# EAGLE design Adafruit ItsyBitsy M4 (EAGLE 9.0.1)
COMPANY: ADAFRUIT INDUSTRIES; DRAWN: KTOWN; REV: B
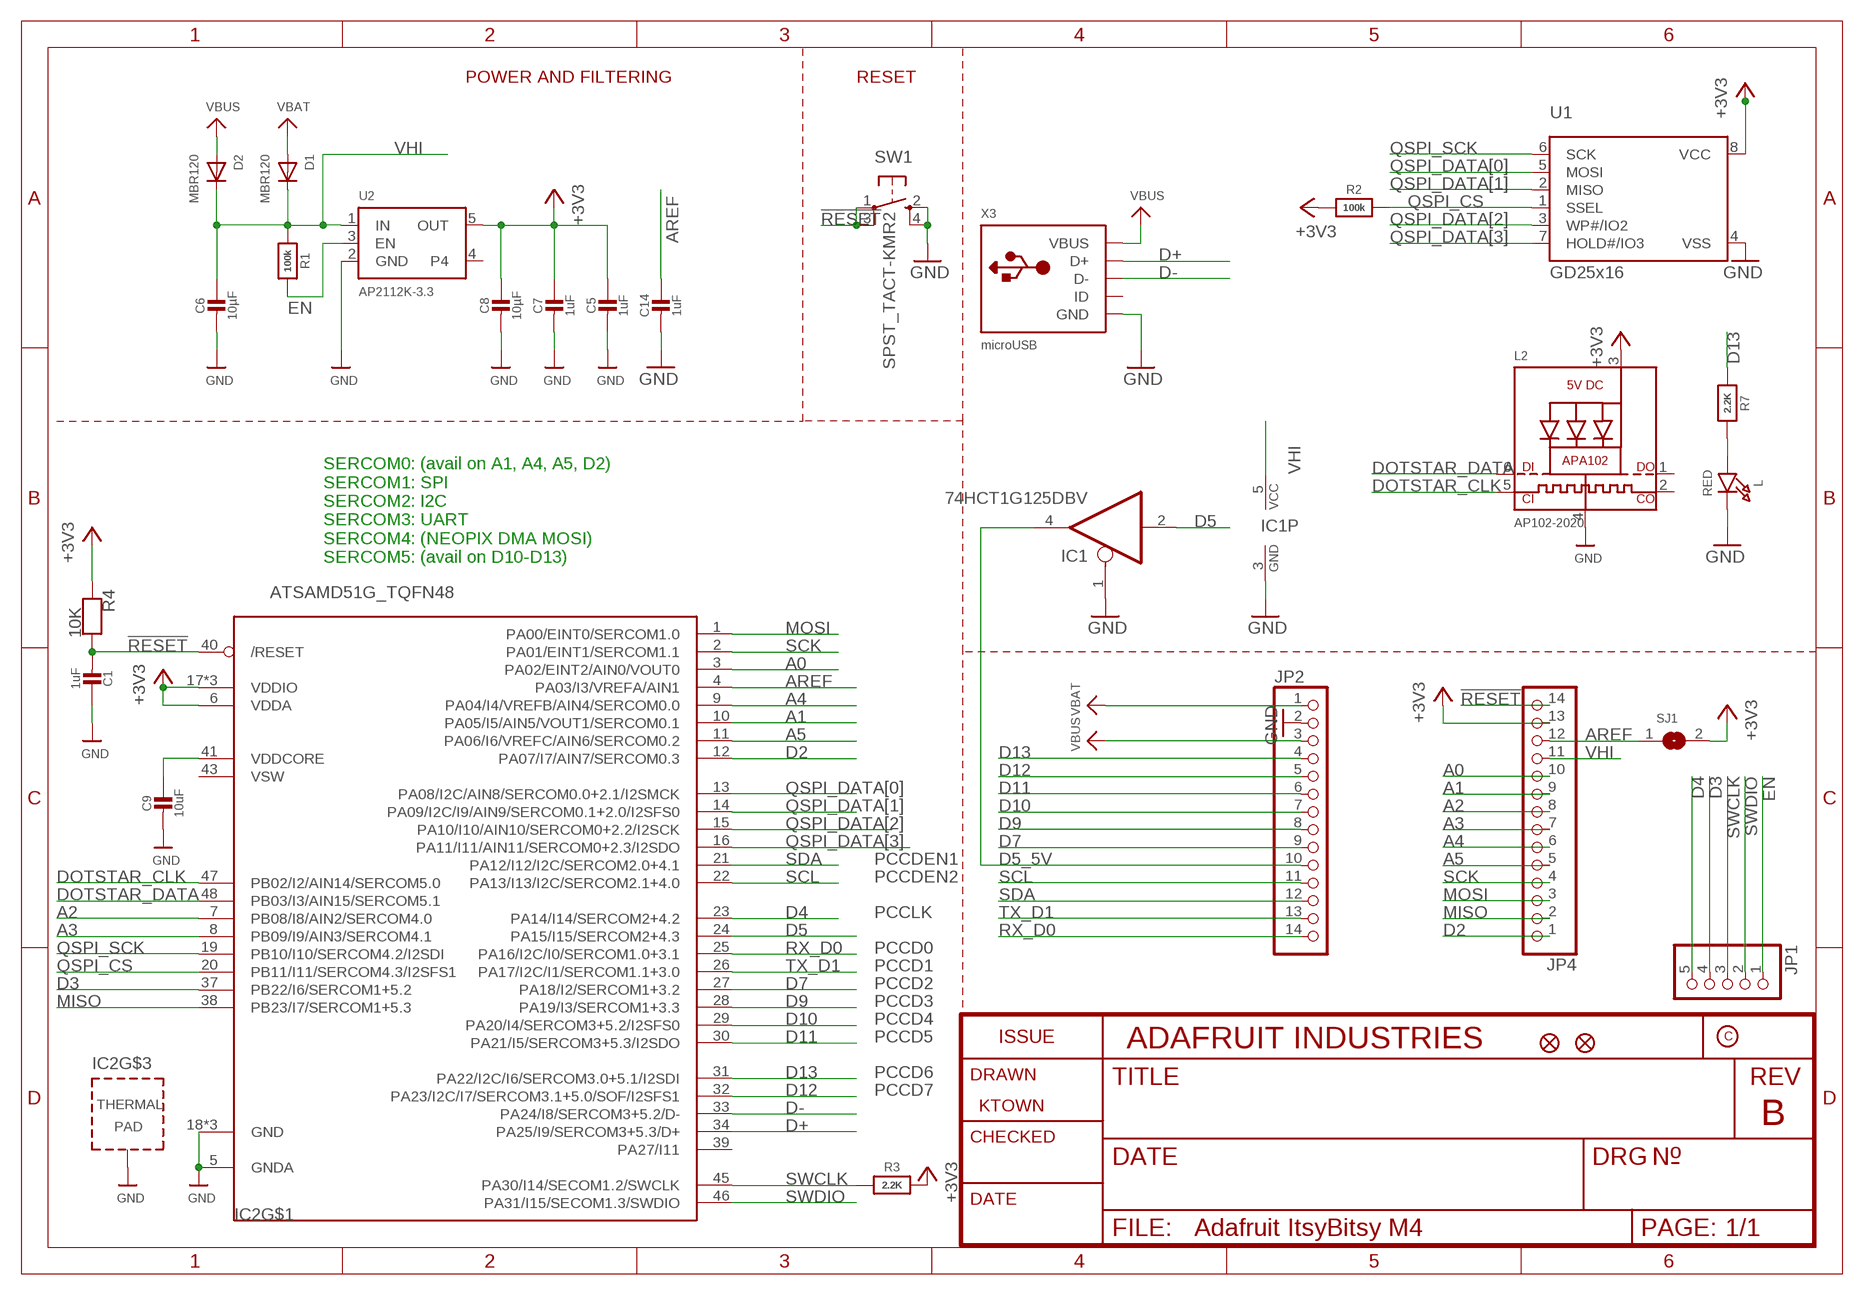
[diagram p0: schematic, sheet 1]

## Parts
C1  1uF  CAP_CERAMIC_0603MP  [_0603MP]
C5  1uF  CAP_CERAMIC0603_NO  [0603-NO]
C6  10µF  CAP_CERAMIC0805-NOOUTLINE  [0805-NO]
C7  1uF  CAP_CERAMIC0603_NO  [0603-NO]
C8  10µF  CAP_CERAMIC0805-NOOUTLINE  [0805-NO]
C9  10uF  CAP_CERAMIC_0805MP  [_0805MP]
C14  1uF  CAP_CERAMIC0603_NO  [0603-NO]
D1  MBR120  DIODE_SOD-123FL  [SOD-123FL]
D2  MBR120  DIODE_SOD-123FL  [SOD-123FL]
IC1  74HCT1G125DBV  74AHC1G125DBV  [SOT23-5]
IC2  ATSAMD51G_TQFN48  [TQFN48_7MM]
JP1  HEADER-1X570MIL  [1X05_ROUND_70]
JP2  HEADER-1X14  [1X14_ROUND70]
JP4  HEADER-1X14  [1X14_ROUND70]
L  RED  LED0603_NOOUTLINE  [CHIPLED_0603_NOOUTLINE]
L2  AP102-2020  APA1022020  [APA102_2020]
R1  100k  RESISTOR_0603_NOOUT  [0603-NO]
R2  100k  RESISTOR_0603_NOOUT  [0603-NO]
R3  2.2K  RESISTOR_0603MP  [_0603MP]
R4  10K  RESISTOR_0603MP  [_0603MP]
R7  2.2K  RESISTOR_0603_NOOUT  [0603-NO]
SJ1  SOLDERJUMPERCLOSED  [SOLDERJUMPER_CLOSEDWIRE]
SW1  SPST_TACT-KMR2  [KMR2]
U1  GD25x16  SPIFLASH_8PINUX  [USON8]
U2  AP2112K-3.3  VREG_SOT23-5  [SOT23-5]
U$34  FIDUCIAL_1MM  [FIDUCIAL_1MM]
U$35  FIDUCIAL_1MM  [FIDUCIAL_1MM]
X3  microUSB  USB_MICRO_20329_V2  [4UCONN_20329_V2]

## Nets
!RESET: C1.2 IC2.40(/RESET) JP4.14 R4.2 SW1.1(P) SW1.3(P1)
+3V3: C5.1 C7.1 C8.1 IC2.6(VDDA) IC2.17(VDDIO) IC2.36(VDDIO) IC2.44(VDDIO) JP4.13 L2.3(VDD) R2.1 R3.2 R4.1 SJ1.2 U1.8(VCC) U2.5(OUT)
A0: IC2.3(PA02/EINT2/AIN0/VOUT0) JP4.10
A1: IC2.10(PA05/I5/AIN5/VOUT1/SERCOM0.1) JP4.9
A2: IC2.7(PB08/I8/AIN2/SERCOM4.0) JP4.8
A3: IC2.8(PB09/I9/AIN3/SERCOM4.1) JP4.7
A4: IC2.9(PA04/I4/VREFB/AIN4/SERCOM0.0) JP4.6
A5: IC2.11(PA06/I6/VREFC/AIN6/SERCOM0.2) JP4.5
AREF: C14.1 IC2.4(PA03/I3/VREFA/AIN1) JP4.12 SJ1.1
D2: IC2.12(PA07/I7/AIN7/SERCOM0.3) JP4.1
D3: IC2.37(PB22/I6/SERCOM1+5.2) JP1.4
D4: IC2.23(PA14/I14/SERCOM2+4.2) JP1.5
D5: IC1.2(I) IC2.24(PA15/I15/SERCOM2+4.3)
D5_5V: IC1.4(O) JP2.10
D7: IC2.27(PA18/I2/SERCOM1+3.2) JP2.9
D9: IC2.28(PA19/I3/SERCOM1+3.3) JP2.8
D10: IC2.29(PA20/I4/SERCOM3+5.2/I2SFS0) JP2.7
D11: IC2.30(PA21/I5/SERCOM3+5.3/I2SDO) JP2.6
D12: IC2.32(PA23/I2C/I7/SERCOM3.1+5.0/SOF/I2SFS1) JP2.5
D13: IC2.31(PA22/I2C/I6/SERCOM3.0+5.1/I2SDI) JP2.4 R7.1
D+: IC2.34(PA25/I9/SERCOM3+5.3/D+) X3.D+
D-: IC2.33(PA24/I8/SERCOM3+5.2/D-) X3.D-
DOTSTAR_CLK: IC2.47(PB02/I2/AIN14/SERCOM5.0) L2.5(CKI)
DOTSTAR_DATA: IC2.48(PB03/I3/AIN15/SERCOM5.1) L2.6(DI)
EN: JP1.1 R1.2 U2.3(EN)
GND: C1.1 C5.2 C6.2 C7.2 C8.2 C9.2 C14.2 IC1.1(OE) IC1.3(GND) IC2.5(GNDA) IC2.18(GND) IC2.35(GND) IC2.42(GND) IC2.THERMAL(TP) JP2.2 L2.4(GND) L.C SW1.2(S) SW1.4(S1) U1.4(VSS) U2.2(GND) X3.BASE@1(GND) X3.BASE@2(GND) X3.GND X3.SPRT@1(GND) X3.SPRT@2(GND) X3.SPRT@3(GND) X3.SPRT@4(GND)
MISO: IC2.38(PB23/I7/SERCOM1+5.3) JP4.2
MOSI: IC2.1(PA00/EINT0/SERCOM1.0) JP4.3
N$2: L.A R7.2
QSPI_CS: IC2.20(PB11/I11/SERCOM4.3/I2SFS1) R2.2 U1.1(SSEL)
QSPI_DATA[0]: IC2.13(PA08/I2C/AIN8/SERCOM0.0+2.1/I2SMCK) U1.5(MOSI)
QSPI_DATA[1]: IC2.14(PA09/I2C/I9/AIN9/SERCOM0.1+2.0/I2SFS0) U1.2(MISO)
QSPI_DATA[2]: IC2.15(PA10/I10/AIN10/SERCOM0+2.2/I2SCK) U1.3(WP#/IO2)
QSPI_DATA[3]: IC2.16(PA11/I11/AIN11/SERCOM0+2.3/I2SDO) U1.7(HOLD#/IO3)
QSPI_SCK: IC2.19(PB10/I10/SERCOM4.2/I2SDI) U1.6(SCK)
RX_D0: IC2.25(PA16/I2C/I0/SERCOM1.0+3.1) JP2.14
SCK: IC2.2(PA01/EINT1/SERCOM1.1) JP4.4
SCL: IC2.22(PA13/I13/I2C/SERCOM2.1+4.0) JP2.11
SDA: IC2.21(PA12/I12/I2C/SERCOM2.0+4.1) JP2.12
SWCLK: IC2.45(PA30/I14/SECOM1.2/SWCLK) JP1.3 R3.1
SWDIO: IC2.46(PA31/I15/SECOM1.3/SWDIO) JP1.2
TX_D1: IC2.26(PA17/I2C/I1/SERCOM1.1+3.0) JP2.13
VBAT: D1.A JP2.1
VBUS: D2.A JP2.3 X3.VBUS
VDDCORE: C9.1 IC2.41(VDDCORE)
VHI: C6.1 D1.C D2.C IC1.5(VCC) JP4.11 R1.1 U2.1(IN)
Unconnected: IC2.39(PA27/I11) L2.1(DO) L2.2(CKO) U2.4 X3.ID

## Notes on the sheet
- POWER AND FILTERING | RESET
- SERCOM0: (avail on A1, A4, A5, D2)
  SERCOM1: SPI
  SERCOM2: I2C
  SERCOM3: UART
  SERCOM4: (NEOPIX DMA MOSI)
  SERCOM5: (avail on D10-D13)
- PCCDEN1
- PCCDEN2
- PCCLK
- PCCD0
- PCCD1
- PCCD2
- PCCD3
- PCCD4
- PCCD5
- PCCD6
- PCCD7

## Power pins joined to a net without a drawn wire
VSW: IC2.43(VSW)

## Library data of the parts
C1 C5-C9 C14 = microbuilder:CAP_CERAMIC: Ceramic Capacitors For new designs, use the packages preceded by an '_' character since they are more reliable: The following footprints should be used on most boards: _0402 - Standard footprint for regular board layouts _0603 - Standard footprint for regular board layouts _0805 - Standard footprint for regular board layouts _1206 - Standard footprint for regular board layouts For extremely tight-pitch boards where space is at a premium, the following 'micro-pitch' footprints can be used (smaller pads, no silkscreen outline, etc.): _0402MP - Micro-pitch footprint for very dense/compact boards _0603MP - Micro-pitch footprint for very dense/compact boards _0805MP - Micro-pitch footprint for very dense/compact boards _1206MP - Micro-pitch footprint for very dense/compact boards
D1 D2 = adafruit:DIODE: Diode SMADIODE - SMA Surface Mount Package 20V 1A Schottky Diode Digikey: 641-1014-6-ND DO-1N4148 - Through Hole Small Current Diode SOD-123 20V 1 A (.5mV Vf) Schottky Diode - Digikey: MBRX120TPMSCT-ND SOD-323 10V 570mA (.38mV Vf, 3ns) Schottky Diode - Digikey: ZLLS410CT-ND SOD-523 30V 30mA Schottky Diode (RB751S-40TE61) - Digikey: RB751S-40TE61CT-ND SOT23-R/W - SOT23 Package (R = Solder Paste/Reflow Ovens, W = Hand-Soldering) BAT54Film 40V 300mA - Digikey: 497-7162-1-ND
IC1 = 74xx-little-us:74*1G125: Single Bus Buffer Gate with 3-State Output
IC2 = microbuilder:ATSAMD51G
JP1 = microbuilder:HEADER-1X5: PIN HEADER
JP2 JP4 = microbuilder:HEADER-1X14
L = microbuilder:LED: LED 0603 - 0603 Surface Mount Package 2mA: Green LED - Low Power (3.9mcd, 2ma, 1.7Vf) - Digikey: 475-2709-2-ND Orange LED - Low Power (9.8mcd, 2ma, 1.8Vf) - Digikey: 475-1194-2-ND Red LED - Low Power (5mcd, 2ma, 1.8Vf) - Digikey: 475-1195-2-ND Yellow LED - Low Power (7mcd, 2ma, 1.8Vf) - Digikey: 475-1196-2-ND 5mA: Blue LED - Low Power (17mcd, 5ma, 2.9Vf) - Digikey: LNJ937W8CRACT-ND 0805 - 0805 Surface Mount Package 2mA: Red LED (8.8mcd, 2mA, 1.8Vf, Clear) - Low Power [Digikey: 475-2510-1-ND] Green LED (5mcd, 2mA, 1.8Vf, Clear) - Low Power [Digikey: 475-2730-1-ND] Yellow LED (11.3mcd, 2mA, 1.8Vf, Clear) - Low Power [Digikey: 475-2555-1-ND] 20mA: Red LED (104mcd, 20mA, Diffused) - LS R976 [Digikey: 475-1278-6-ND] Red LED (12mcd, 20mA, 2.0Vf, Clear) - APT2012EC [Digikey: 754-1128-1-ND] Green LED (15mcd, 20mA, 2.2Vf, Clear) - APT2012GC [Digikey: 754-1131-1-ND] Orange LED (160mcd, 20mA, 2.1Vf, Clear) - APT2012SECK [Digikey: 754-1130-1-ND] 1206 - 1206 Surface Mount Package Green LED (26mcd, 20mA, Diffused) - LG N971 [Digikey: 475-1407-6-ND] Red LED (15mcd, 20mA, Diffused) - LH N974 [Digikey: 475-1416-6-ND] Cree - Cree High-Power Surface Mount LEDs XPEBWT-L1-0000-00D50 - White 111lm 350mA 2.9Vf 6200K 110° XTEAWT-00-0000-00000LEE3 - White 114lm 350mA 2.85Vf 5000K 115° Everlight - Everlight 45-21 Series Surface Mount LEDs 45-21/QK2C-B2832AC2CB2/2T - Warm White 2000mcd 20mA 3.25Vf 3050K 120° 45-21/LK2C-B38452C4CB2/2T - Nuetral White 2000mcd 20mA 3.25Vf 4150K 120° 45-21/LK2C-B50634C6CB2/2T - Cold White 2200mcd 20mA 3.25Vf 5650K 120° PLCC2 Reverse Mount LS T77K-J1L2-1-0-2-R18-Z - Red 11.25mcd 2mA 1.8Vf 630nm 120° LO T77K-L1M2-24-Z - Orange 19.6mcd 2mA 1.8Vf 606nm 120° LY T77K-K2M1-26-Z - Yellow 15.7mcd 2mA 1.8Vf 587nm 120°
L2 = microbuilder:APA102: APA102/DotStar Pixels VCC: 5V DC Refresh Rate: 400Hz
R1-R4 R7 = microbuilder:RESISTOR: Resistors For new designs, use the packages preceded by an '_' character since they are more reliable: The following footprints should be used on most boards: _0402 - Standard footprint for regular board layouts _0603 - Standard footprint for regular board layouts _0805 - Standard footprint for regular board layouts _1206 - Standard footprint for regular board layouts For extremely tight-pitch boards where space is at a premium, the following 'micro-pitch' footprints can be used (smaller pads, no silkscreen outline, etc.): _0402MP - Micro-pitch footprint for very dense/compact boards _0603MP - Micro-pitch footprint for very dense/compact boards _0805MP - Micro-pitch footprint for very dense/compact boards _1206MP - Micro-pitch footprint for very dense/compact boards
SJ1 = microbuilder:SOLDERJUMPER: SMD Solder JUMPER Solder the two pads together to create a connection, or remove the solder to break it. REFLOW - Use this footprint for solder paste and reflow ovens. WAVE - Use this footprint for hand-soldering (larger pads). CLOSED - Has a trace between the two pads to ensure it is closed by default. The trace needs to be cut to disable the jumper, and can be closed again by creating a solder bridge between the two pads.
SW1 = adafruit:SPST_TACT: SMT 6mm switch, EVQQ2 series http://www.ladyada.net/library/eagle
U1 = microbuilder:SPIFLASH_8PIN: SOIC8 SPI Flash Be careful with the size since SOIC8 flash comes in several 'widths' SOIC8 150 mil M25P16 - 16Mbit (2Mbit x 8) Serial Flash (75MHz SPI Bus), Supply: 2.7-3.6V Digikey: SOIC8 - M25P16-VMN6P-ND SOIC8 208 mil W25Q16BVSSIG - 16Mbit (2Mbit x 8) Serial Flash (104MHz SPI Bus), Supply: 2.7-3.6V Digikey: SOIC8 - W25Q16BVSSIG-ND
U2 = microbuilder:VREG_SOT23-5: SOT23-5 Fixed Voltage Regulators Part Current Out V Out V In V Dropout θJA (°C/W) TJ (°C) Digikey Part No. ADP121 150mA 3.3V 3.4-5.5V 0.09V @ 150mA -- -- ADP121-AUJZ33R7CT-ND ADP121 150mA 3.0V 3.1-5.5V 0.09V @ 150mA -- -- ADP121-AUJZ30R7CT-ND ADP122 300mA 3.3V 3.4-5.5V 0.085V @ 300mA -- -- ADP122AUJZ-3.3-R7CT-ND ADP1712 300mA 3.3V 3.5-5.5V 0.17V @ 300mA -- -- ADP1712AUJZ-3.3-R7TR-ND AP7311 (Low Cost) 150mA 3.3V 3.5-6V 0.15V @ 150mA -- -- AP7311-33WG-7DICT-ND LD39015M18R 150mA 1.8V 1.9V-5.5V 0.08V @ 100mA -- -- 497-6977-1-ND LP2985A-33DBVR 150mA 3.3V 3.3-16V 0.28V @ 150mA 206 150 296-18479-1-ND MCP1824T-3302E/OT 300mA 3.3V 3.5V-6V 0.2V @ 300mA -- -- MCP1824T-3302E/OTCT-ND MIC5205-2.5YM5 TR 150mA 2.5V 2.7-16V 0.165V @ 150mA -- -- 576-1257-2-ND MIC5205-3.0YM5 TR 150mA 3.0V 3.2V-16V 0.165V @ 150mA -- -- 576-1258-2-ND MIC5205-3.3YM5 TR 150mA 3.3V 3.5V-16V 0.165V @ 150mA -- -- 576-1259-2-ND TPS780330220 150mA 3.3V+2.2V 3.6-5.5V 250mV Max -- -- 296-23332-1-ND TDA3663/N1,135 100mA 3.3V 3.5-45V 0.18V @ 50mA -- -- 568-5343-1-ND Max operating temp can be calculated using θJA, TJ (max junction temperature), and power in watts. Set the "Maximum Ambient Temperature" until it reaches TJ ("Max Junction Temperature"), which is the absolute limit for safe use of the regulator: Heat Sink Temperature Calculator <http://www.daycounter.com/Calculators/Heat-Sink-Temperature-Calculator.phtml> For example, With 12V source into a 3.3V LP2985 and a 30mA load, we are dissipating (12V-3.3V) * 0.03A = 0.261W. With a θJA of 206 °C/W, a TJ of 150°C, and 261mW we can safely use the chip without a heat sink up to 75°C (=147.1°C Junction Temperature).
U$34 U$35 = microbuilder:FIDUCIAL: Fiducial Alignment Points Various fiducial points for machine vision alignment.; BOM: EXCLUDE
X3 = microbuilder:USB: USB Connectors USBMINIB - Surface Mount Female Mini-B USB Connector 4UConnector: 06564

## Board
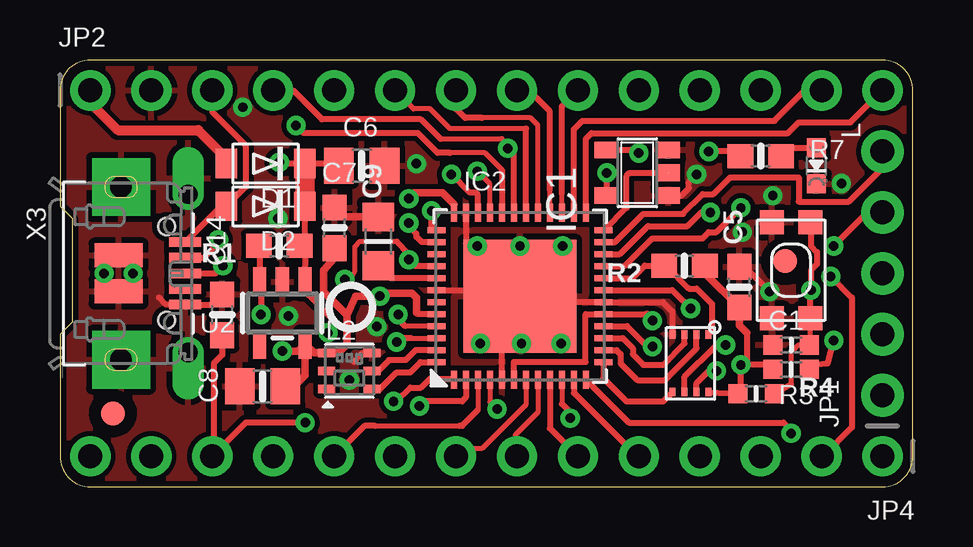
[diagram p1: board, top side]
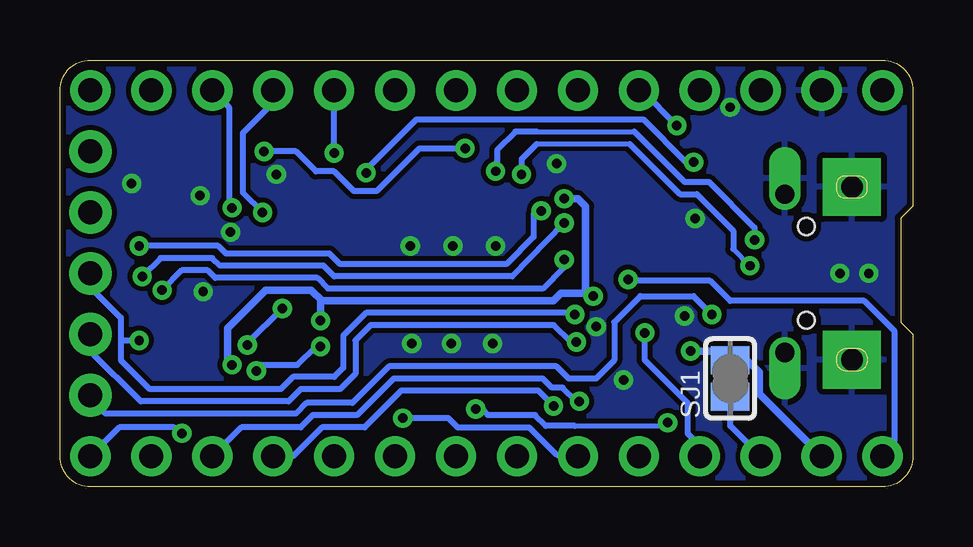
[diagram p2: board, bottom side, seen from below]

Size 35.56 x 17.78 mm. Coordinates in mm from the lower left corner, seen from the top.
Outline: 0,6.35 0,1.27 arc90 1.27,0 34.29,0 arc90 35.56,1.27 35.56,16.51 arc90 34.29,17.78 1.27,17.78 arc90 0,16.51 0,11.68 0.51,11.18 0.51,6.86 0,6.35
Copper layers (1*16): Top 0.035mm / dielectric 1.5mm / Bottom 0.035mm
Design rules "adafruit *": minimum track width 8mil, minimum drill 15.5mil, track to track 8mil, track to pad 8mil, pad to pad 8mil, via to via 8mil, smd to smd 8mil, copper to edge 10mil, drill to drill 8mil, minimum pad ring 10mil, minimum via ring 8mil, stop-mask expansion 2mil, vias tented up to drill 20mil, thermal gap 10mil

### Footprints (pad centres in the part's own frame; a part is rotated, then mirrored left to right if it is on the bottom)
_0603MP = smd 0.8 x 0.8: 1 -0.762,0; 2 0.762,0
0603-NO = smd 1.075 x 1: 1 -0.85,0; 2 0.85,0
0805-NO = smd 1.24 x 1.5: 1 -0.95,0; 2 0.95,0
_0805MP = smd 1.2 x 1.3: 1 -1.016,0; 2 1.016,0
SOD-123FL = smd 0.91 x 1.22: A 1.637,0; C -1.637,0
SOT23-5 = smd 0.69 x 0.99: 1 -0.95,-1.29; 2 0,-1.29; 3 0.95,-1.29; 4 0.95,1.3; 5 -0.95,1.3
TQFN48_7MM = smd 0.25 x 0.75: 1 -2.75,-3.475; 2 -2.25,-3.475; 3 -1.75,-3.475; 4 -1.25,-3.475; 5 -0.75,-3.475; 6 -0.25,-3.475; 7 0.25,-3.475; 8 0.75,-3.475; 9 1.25,-3.475; 10 1.75,-3.475; 11 2.25,-3.475; 12 2.75,-3.475; 25 2.75,3.475; 26 2.25,3.475; 27 1.75,3.475; 28 1.25,3.475; 29 0.75,3.475; 30 0.25,3.475; 31 -0.25,3.475; 32 -0.75,3.475; 33 -1.25,3.475; 34 -1.75,3.475; 35 -2.25,3.475; 36 -2.75,3.475 | smd 0.75 x 0.25: 13 3.475,-2.75; 14 3.475,-2.25; 15 3.475,-1.75; 16 3.475,-1.25; 17 3.475,-0.75; 18 3.475,-0.25; 19 3.475,0.25; 20 3.475,0.75; 21 3.475,1.25; 22 3.475,1.75; 23 3.475,2.25; 24 3.475,2.75; 37 -3.475,2.75; 38 -3.475,2.25; 39 -3.475,1.75; 40 -3.475,1.25; 41 -3.475,0.75; 42 -3.475,0.25; 43 -3.475,-0.25; 44 -3.475,-0.75; 45 -3.475,-1.25; 46 -3.475,-1.75; 47 -3.475,-2.25; 48 -3.475,-2.75 | smd 4.7 x 4.7: THERMAL 0,0
1X05_ROUND_70 = drill 1 pad 1.778: 1 -5.08,0; 2 -2.54,0; 3 0,0; 4 2.54,0; 5 5.08,0
1X14_ROUND70 = drill 1 pad 1.676: 1 -16.51,0; 2 -13.97,0; 3 -11.43,0; 4 -8.89,0; 5 -6.35,0; 6 -3.81,0; 7 -1.27,0; 8 1.27,0; 9 3.81,0; 10 6.35,0; 11 8.89,0; 12 11.43,0; 13 13.97,0; 14 16.51,0
CHIPLED_0603_NOOUTLINE = smd 0.8 x 0.8: A 0,-0.75; C 0,0.75
APA102_2020 = smd 0.7 x 0.35: 1 -0.95,-0.75; 2 -0.95,0; 3 -0.95,0.75; 4 0.95,0.75; 5 0.95,0; 6 0.95,-0.75
SOLDERJUMPER_CLOSEDWIRE = smd 1.168 x 1.6: 1 -0.762,0; 2 0.762,0 | smd 0.635 x 0.203: WIRE 0,0
KMR2 = smd 1 x 1: 1 2,0.8; 2 2,-0.8; 3 -2,0.8; 4 -2,-0.8
USON8 = smd 0.35 x 0.25: 1 -1.2,0.75; 2 -1.2,0.25; 3 -1.2,-0.25; 4 -1.2,-0.75; 5 1.2,-0.75; 6 1.2,-0.25; 7 1.2,0.25; 8 1.2,0.75
SOT23-5' = smd 0.55 x 1.2: 1 -0.95,-1.3; 2 0,-1.3; 3 0.95,-1.3; 4 0.95,1.3; 5 -0.95,1.3
FIDUCIAL_1MM = smd 1 x 1: 1 0,0
4UCONN_20329_V2 = smd 1 x 2: BASE@1 -0.75,-2; BASE@2 0.75,-2 | smd 0.4 x 1.35: D+ 0,0.775; D- -0.65,0.775; GND 1.3,0.775; ID 0.65,0.775; VBUS -1.3,0.775 | drill 0.8 pad 1.143 offset: SPRT@1 -3.3,0.9; SPRT@2 3.3,0.9 | drill 0.9 pad 2.413 square: SPRT@3 -3.6,-1.9; SPRT@4 3.6,-1.9 | hole 0.7: -1.95,0; 1.95,0

### Placement (x,y rotation side)
C1  30.48,5.91 0 top
C5  28.32,8.32 90 top
C6  12.58,13.38 0 top
C7  11.45,10.78 90 top
C8  8.45,4.18 180 top
C9  13.27,10.22 90 top
C14  6.77,7.16 90 top
D1  8.57,13.46 180 top
D2  8.57,11.68 180 top
IC1  24.07,13.08 90 top
IC2  19.18,7.94 0 top
JP1  34.29,8.89 90 top
JP2  17.78,16.51 0 top
JP4  17.78,1.27 180 top
L  31.54,13.38 180 top
L2  12.06,4.83 0 top
R1  9.14,10.03 180 top
R2  26.04,9.21 180 top
R3  30.48,4.89 180 top
R4  29.02,3.87 0 top
R7  29.21,13.78 0 top
SJ1  7.62,4.51 90 bottom
SW1  30.48,9.02 270 top
U1  26.29,5.14 270 top
U2  AP2112K-3.3  [SOT23-5']  9.27,7.24 180 top
U$4  [ITSYM4_TOP]  0,0 0 top
U$5  [ITSYM4_BOT]  35.56,0 0 bottom
U$6  [PCBFEAT-REV-040]  12.13,7.49 0 top
U$34  30.23,9.4 270 top
U$35  2.21,3.06 270 top
X3  4.45,8.89 270 top

### Tracks (layer width: path | path; a pad name or v marks a point on that pad's centre or on a via)
!RESET  (via drill 0.39)
  Top 0.203: 14.03,10.22 12.51,10.22 12.29,10.01 12.29,8.99 12.13,8.7 | SW1.1 31.28,6.01 C1.2 30.8,5.91 30.48,5.59 30.48,4.28
  Top 0.254: IC2.40 14.82,9.19 v14.54,9.46 14.54,9.72 14.03,10.22 | 12.13,8.7 v11.87,8.64 | v31.3,8.19 31.3,9.02 31.56,9.27 31.56,9.78 31.3,10.03 31.3,10.93 31.28,10.95 SW1.3 | 31.3,8 v31.3,8.19 | 31.03,6.96 SW1.1 31.28,8.17 v31.3,8.19 | 30.48,4.28 30,3.99 R4.2
  Bottom 0.203: 1.27,1.4 JP4.14
  Bottom 0.254: 1.27,1.4 0.76,1.91 0.76,6.48 2.03,7.75 7.62,7.75 8.45,8.57 11.68,8.57 11.81,8.7 v11.87,8.64 | v14.54,9.46 14.54,9.14 15.43,8.26 24.38,8.26 24.83,8.7 29.08,8.7 29.4,9.02 30.48,9.02 v31.3,8.19 31.3,8.34
+3V3  (via drill 0.39)
  Top 0.254: IC2.6 18.93,5.21 21.91,5.21 21.91,7.18 21.92,7.19 IC2.17 24.46,7.19 | U2.5 10.19,5.97 | 16.43,11.77 IC2.36 | IC2.44 14.91,7.19 14.86,7.24 | L2.3 | 24.7,6.95 v24.7,6.92 | U1.8 R4.1 28.38,4.1 v28.38,5.08 | R3.2 29.5,5.08 v28.38,5.08 | 28.64,6.41 28.64,5.08 v28.38,5.08
  Top 0.305: L2.3 10.58,5.58 U2.5 9.93,5.65 v9.27,5.65 | C8.1 9.76,4.18 10.22,4.64 U2.5 | 11.97,7.14 11.97,5.94 11.62,5.59 L2.3 | v14.54,12 14.73,12.26 15.94,12.26 16.43,11.77 | 28.64,6.41 28.32,6.73 C5.1 26.95,8.84 R2.1 | 11.97,7.14 10.99,8.13 10.99,9.02 11.45,9.54 C7.1 | 11.97,7.14 12.32,7.94 v13.34,7.94 13.46,8.06 14.67,8.06 14.86,7.87 14.86,7.24 | 24.46,7.19 24.7,6.95
  Bottom 0.254: 13.65,8.26 v13.34,7.94 | 24.7,7.68 24.64,7.75
  Bottom 0.305: JP4.13 6.41,3.87 6.41,4.76 6.92,5.27 SJ1.2 8,5.65 v9.27,5.65 | v13.34,7.94 13.46,8.06 14.67,8.06 14.99,7.75 24.64,7.75 25.08,8.19 26.99,8.19 28.57,6.6 28.57,5.27 v28.38,5.08 | 13.65,8.26 13.65,11.68 13.97,12 v14.54,12 | v24.7,6.92 24.7,7.68
A0
  Top 0.203: IC2.3 17.43,3.2 | 13.14,2.54 16.64,2.54
  Top 0.254: 13.14,2.54 12.7,2.54 JP4.10 | 17.43,3.2 16.76,2.54 16.64,2.54
A1  (via drill 0.39)
  Top 0.203: IC2.10 20.93,3.46
  Top 0.254: 20.93,3.46 21.27,3.11 v21.27,2.86
  Bottom 0.254: JP4.9 14.03,1.33 14.86,1.33 16,2.48 18.99,2.48 19.37,2.86 v21.27,2.86
A2
  Top 0.203: IC2.7 19.43,3.42 17.59,1.59 16.83,1.59 JP4.8
A3
  Top 0.203: IC2.8 19.93,3.1 18.99,2.16 18.99,1.33 JP4.7
A4
  Top 0.254: IC2.9 20.43,2.43 JP4.6
A5
  Top 0.254: IC2.11 21.43,3.91 24.07,1.27 JP4.5
AREF  (via drill 0.39)
  Top 0.203: IC2.4 17.93,3.54 v18.22,3.24
  Top 0.254: v10.22,2.67 7.75,2.67 JP4.12 6.41,1.33 6.41,5.14 6.77,5.5 C14.1
  Bottom 0.203: 14.1,2.54 10.54,2.54 10.41,2.67 v10.22,2.67
  Bottom 0.254: 14.1,2.54 15.3,2.54 15.75,2.98 17.72,2.98 17.97,3.24 v18.22,3.24 | JP4.12 7.62,2.54 7.62,3.43 SJ1.1
D2  (via drill 0.39)
  Top 0.254: IC2.12 23.72,2.67 30.16,2.67 30.48,2.35 v30.48,2.22
  Bottom 0.254: v30.48,2.22 30.54,2.22 30.8,2.48 33.08,2.48 JP4.1
D3  (via drill 0.39)
  Top 0.254: IC2.37 15.6,10.69 15.49,10.79 v15.49,11.49 | v32.26,10.03 33.66,11.43 JP1.4
  Bottom 0.254: v15.49,11.49 15.68,11.49 15.81,11.37 15.81,10.41 16.95,9.27 23.88,9.27 24.32,9.72 28.64,9.72 28.96,10.03 v32.26,10.03
D4
  Top 0.254: IC2.23 23.14,10.19 24.32,11.37 25.97,11.37 26.8,12.19 27.24,12.19 27.94,12.89 30.8,12.89 30.8,11.87 32.89,11.87 34.29,13.27 JP1.5
D5
  Top 0.254: IC1.2 23.75,13.08 23.62,12.95 23.62,11.62 22.69,10.69 IC2.24
D5_5V  (via drill 0.39)
  Top 0.254: IC1.4 24.01,14.03 v24.13,13.91
  Bottom 0.254: v24.13,13.91 JP2.10
D7
  Top 0.203: IC2.27 20.93,12.23
  Top 0.254: 20.93,12.23 20.93,15.85 JP2.9
D9
  Top 0.203: IC2.28 20.43,12.36
  Top 0.254: 20.43,12.36 20.43,15.64 19.56,16.51 JP2.8
D10
  Top 0.203: IC2.29 19.93,15.06 19.62,15.37 17.59,15.37
  Top 0.254: 17.59,15.37 16.89,15.37 16.51,15.75 JP2.7
D11
  Top 0.203: 19.43,14.92 16.26,14.92 15.43,15.75 14.73,15.75 JP2.6
  Top 0.254: IC2.30 19.43,14.92
D12  (via drill 0.39)
  Top 0.203: 18.42,13.2 17.72,13.91 16.26,13.91
  Top 0.254: 18.42,13.2 18.43,13.2 IC2.32 | 16.26,13.91 15.75,13.91 14.92,14.73 10.16,14.73 v9.84,15.05
  Bottom 0.254: v9.84,15.05 11.3,16.51 JP2.5
D13  (via drill 0.39)
  Top 0.203: 18.41,14.48 15.88,14.48
  Top 0.254: 15.88,14.48 15.05,15.3 10.92,15.3 9.72,16.51 JP2.4 | IC2.31 18.93,13.84 v18.67,14.1 18.67,14.22 18.41,14.48 | R7.1 28.17,13.97 v27.05,13.97
  Bottom 0.254: v18.67,14.1 20.57,14.1 22.35,12.32 23.3,12.32 24.13,13.14 24.89,13.14 25.72,13.97 v27.05,13.97
D+  (via drill 0.39)
  Top 0.254: X3.D+ 6.48,8.89 v6.79,9.21 | IC2.34 17.43,12.16 17.34,12.26 17.08,12.26 v16.32,13.02
  Bottom 0.203: v6.79,9.21 7.49,9.91 | 15.68,14.29 11.81,14.29
  Bottom 0.254: 11.81,14.29 9.72,12.19 9.02,12.19 7.49,10.67 7.49,9.91 | 15.68,14.29 16.32,13.65 v16.32,13.02
D-  (via drill 0.39)
  Top 0.203: IC2.33 17.93,12.62 v17.4,13.14
  Top 0.254: X3.D- 5.98,9.54 6.6,10.16 v6.6,10.29
  Bottom 0.203: 15.68,14.8 11.62,14.8
  Bottom 0.254: 11.62,14.8 9.53,12.7 8.51,12.7 6.6,10.79 v6.6,10.29 | 15.68,14.8 16.57,14.8 17.34,14.03 17.34,13.21 v17.4,13.14
DOTSTAR_CLK
  Top 0.254: IC2.47 14.83,5.69 14.41,5.27 13.72,5.27 13.27,4.83 L2.5
DOTSTAR_DATA
  Top 0.254: L2.6 13.35,4.08 14.03,4.76 14.61,4.76 15.03,5.19 IC2.48
EN  (via drill 0.39)
  Top 0.254: R1.2 8.32,9.93 U2.3 8.38,8.48 v8.38,7.18
  Bottom 0.254: JP1.1 34.29,3.68 33.66,3.05 25.72,3.05 25.27,3.49 23.37,3.49 21.84,5.02 14.86,5.02 14.35,4.51 13.21,4.51 12.45,5.27 12.45,6.86 11.37,7.94 9.14,7.94 v8.38,7.18
GND  (via drill 0.39)
  Top 0.254: IC2.42 17.46,8.19 | 17.46,8.19 | IC2.35 16.93,10.12 17.27,9.78 17.34,9.78 IC2.THERMAL | IC2.5 18.43,6.21 | 18.43,6.21 18.41,6.22 | 20.7,7.69 IC2.18 25.14,7.69 25.54,7.29 U1.4 | 20.7,7.69 20.7,7.68 | 4.13,7.87 4.41,7.59 X3.GND 6.34,7.59 C14.2 | 18.43,6.21 18.43,7.19 IC2.THERMAL | 17.46,8.19 18.93,8.19 IC2.THERMAL | 20.7,7.69 19.43,7.69 IC2.THERMAL | IC1.1 25.91,12.13 26.23,12.45 26.23,12.7 v26.54,13.02 | C5.2 28.55,9.17 29.34,8.38 | L2.4 12.62,5.58 12.26,5.21
  Top 0.305: C7.2 11.84,11.24 C9.2
  other vias: 1.84,8.89 3.05,8.89 14.86,13.46 9.53,7.11 12.06,4.45 17.53,5.97 19.24,5.97 20.89,5.97 32.58,12.64 29.72,12.13 29.59,8.13 7.62,15.81 17.4,10.03 19.18,10.03 20.95,10.03 13.21,6.67 9.08,11.18 28.45,10.6
  pour Top: 0,17.78 0,0 35.56,0 35.56,17.78
  pour Bottom: 0,17.78 0,0 35.56,0 35.56,17.78
MISO  (via drill 0.39)
  Top 0.254: IC2.38 15.09,10.19 14.86,10.41 14.86,10.54 14.48,10.92 v14.54,10.99 | v32.13,8.76 33.02,7.87 33.02,2.48 31.81,1.27 JP4.2
  Bottom 0.254: v14.54,10.99 16.7,8.76 24.13,8.76 24.57,9.21 28.89,9.21 29.21,9.53 31.37,9.53 v32.13,8.76
MOSI  (via drill 0.39)
  Top 0.254: v13.91,3.56 14.03,3.56 14.61,4.13 15.05,4.13 15.43,4.51 16.38,4.51 IC2.1
  Bottom 0.254: JP4.3 28,2.48 25.53,2.48 25.02,2.98 23.18,2.98 21.65,4.51 15.43,4.51 15.05,4.13 14.61,4.13 14.03,3.56 v13.91,3.56
N$2
  Top 0.254: R7.2 30.41,14.13 L.A
QSPI_CS
  Top 0.254: IC2.20 23.86,8.69 24.38,9.21 R2.2 25.27,9.21 26.23,8.26 26.54,8.26 27.18,7.62 27.18,6.48 U1.1
QSPI_DATA[0]
  Top 0.254: 25.51,3.92 U1.5 25.15,3.56 23.62,3.56 22.65,4.53 IC2.13
QSPI_DATA[1]
  Top 0.254: IC2.14 23.2,5.69 23.37,5.52 23.37,5.14 24.07,4.45 25.21,4.45 26.54,5.78 U1.2
QSPI_DATA[2]
  Top 0.254: IC2.15 23.47,6.19 23.88,5.78 23.88,5.52 24.32,5.08 25.15,5.08 26.04,5.97 U1.3
QSPI_DATA[3]  (via drill 0.39)
  Top 0.254: IC2.16 23.64,6.69 24.49,5.84 v24.7,5.84 | U1.7 26.54,4.31 27.05,4.83 v27.37,4.83
  Bottom 0.254: v27.37,4.83 27.11,5.08 25.65,5.08 24.89,5.84 v24.7,5.84
QSPI_SCK  (via drill 0.39)
  Top 0.254: IC2.19 25.53,8.19 v26.29,7.43 | U1.6 26.04,4.58 27.3,5.84 27.69,5.84 v27.75,5.91
  Bottom 0.254: v26.29,7.43 27.75,5.97 v27.75,5.91
RX_D0
  Top 0.254: IC2.25 21.93,14.5 22.16,14.73 30.35,14.73 30.8,15.18 32.96,15.18 JP2.14
SCK  (via drill 0.39)
  Top 0.254: IC2.2 16.93,3.72 16.76,3.56 15.18,3.56 v14.99,3.37
  Bottom 0.254: v14.99,3.37 15.62,4 21.34,4 22.86,2.48 24.64,2.48 25.84,1.27 JP4.4
SCL  (via drill 0.39)
  Top 0.254: IC2.22 23.34,9.69 24.51,10.86 26.16,10.86 26.73,11.43 v27.11,11.43
  Bottom 0.254: JP2.11 26.61,16.45 26.61,16.07 27.94,14.73 27.94,12.26 v27.11,11.43
SDA  (via drill 0.39)
  Top 0.254: IC2.21 23.54,9.19 24.7,10.35 26.8,10.35 27.05,10.6 27.37,10.6 v28.38,11.62
  Bottom 0.254: JP2.12 28.51,15.81 28.51,11.75 v28.38,11.62
SWCLK  (via drill 0.39)
  Top 0.203: IC2.45 14.39,6.69
  Top 0.254: 14.39,6.69 14.1,6.99 v14.1,7.18 | R3.1 31.24,5.08 32,5.14 v32.26,6.1
  Bottom 0.254: JP1.3 34.29,8.32 33.02,7.05 33.02,6.1 | v14.1,7.18 14.16,7.18 14.22,7.24 22.8,7.24 23.75,6.29 23.75,4.95 24.13,4.57 25.84,4.57 26.35,4.06 31.81,4.06 33.02,5.27 33.02,6.1 | 33.02,6.1 v32.26,6.1
SWDIO  (via drill 0.39)
  Top 0.203: 14.63,6.19 IC2.46
  Top 0.254: 14.63,6.19 14.19,6.19 v14.03,6.03
  Bottom 0.254: v14.03,6.03 14.29,6.03 14.99,6.73 22.61,6.73 23.24,6.1 23.24,4.7 23.88,4.06 25.53,4.06 26.04,3.56 32.19,3.56 34.29,5.65 JP1.2
TX_D1
  Top 0.254: IC2.26 21.43,14.89 21.78,15.24 29.78,15.24 31.05,16.51 JP2.13
VBAT
  Top 0.406: JP2.1 1.27,16 2.41,14.86 5.77,14.86 6.93,13.69 D1.A
VBUS
  Top 0.254: X3.VBUS 6.71,11.68 D2.A 7.75,12.5 7.75,14.22 6.35,15.62 JP2.3
VDDCORE
  Top 0.254: IC2.41 13.77,8.69 C9.1
VHI  (via drill 0.39)
  Top 0.254: 22.8,12.16 v22.8,13.08 | C6.1 11.54,13.46 D1.C 9.21,13.46 v9.14,13.53 | D2.C 10.21,10.12 R1.1 10.25,9.85 U2.1 10.16,8.48 10.38,7.97 11.3,7.05 11.3,6.54 v11.18,6.41
  Top 0.305: 22.8,12.16 IC1.5
  Top 0.813: D2.C D1.C
  Bottom 0.203: 9.46,13.53 v9.14,13.53
  Bottom 0.254: 9.46,13.53 11.24,15.3 20.7,15.3 22.8,13.21 v22.8,13.08 | JP4.11 8.89,1.71 9.4,2.22 9.4,3.49 11.18,5.27 v11.18,6.41